# EAGLE design MainMCU (EAGLE 9.6.2)
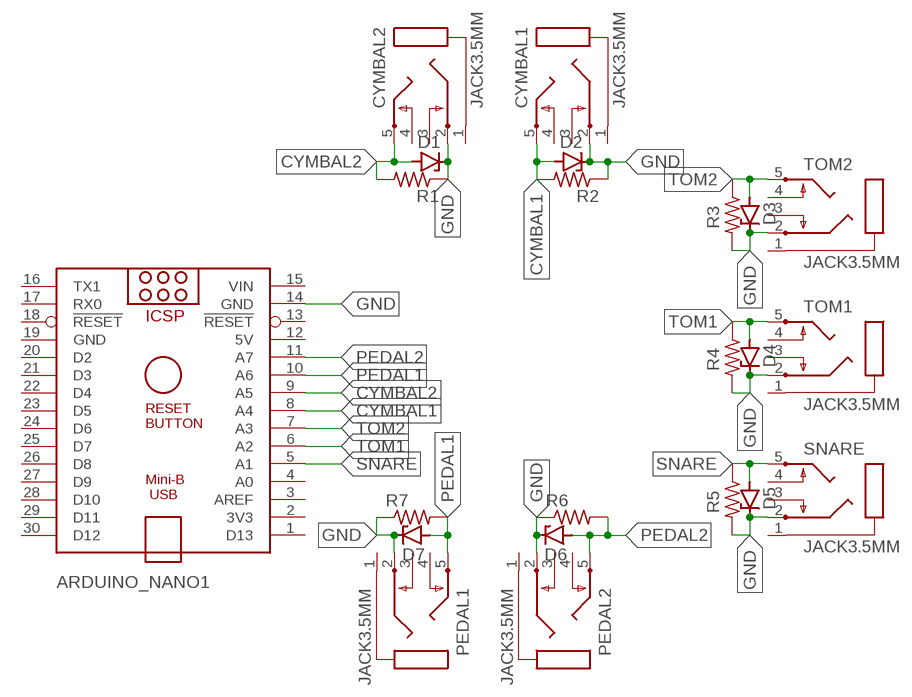
[diagram p0: schematic, sheet 1]

## Parts
ARDUINO_NANO1  ARDUINO_NANO  [ARDUINO_NANO]
CYMBAL1  JACK3.5MM  [PG203J]
CYMBAL2  JACK3.5MM  [PG203J]
D1  ZENER-DIODEDO34-7  [DO34Z7]
D2  ZENER-DIODEDO34-7  [DO34Z7]
D3  ZENER-DIODEDO34-7  [DO34Z7]
D4  ZENER-DIODEDO34-7  [DO34Z7]
D5  ZENER-DIODEDO34-7  [DO34Z7]
D6  ZENER-DIODEDO34-7  [DO34Z7]
D7  ZENER-DIODEDO34-7  [DO34Z7]
PEDAL1  JACK3.5MM  [PG203J]
PEDAL2  JACK3.5MM  [PG203J]
R1  R-US_0207/10  [0207/10]
R2  R-US_0207/10  [0207/10]
R3  R-US_0207/10  [0207/10]
R4  R-US_0207/10  [0207/10]
R5  R-US_0207/10  [0207/10]
R6  R-US_0207/10  [0207/10]
R7  R-US_0207/10  [0207/10]
SNARE  JACK3.5MM  [PG203J]
TOM1  JACK3.5MM  [PG203J]
TOM2  JACK3.5MM  [PG203J]

## Nets
CYMBAL1: ARDUINO_NANO1.8(A4) CYMBAL1.5 D2.A R2.2
CYMBAL2: ARDUINO_NANO1.9(A5) CYMBAL2.5 D1.A R1.2
GND: ARDUINO_NANO1.14(GND) CYMBAL1.2 CYMBAL2.2 D1.C D2.C D3.C D4.C D5.C D6.C D7.C PEDAL1.2 PEDAL2.2 R1.1 R2.1 R3.2 R4.2 R5.2 R6.1 R7.1 SNARE.2 TOM1.2 TOM2.2
PEDAL1: ARDUINO_NANO1.10(A6) D7.A PEDAL1.5 R7.2
PEDAL2: ARDUINO_NANO1.11(A7) D6.A PEDAL2.5 R6.2
SNARE: ARDUINO_NANO1.5(A1) D5.A R5.1 SNARE.5
TOM1: ARDUINO_NANO1.6(A2) D4.A R4.1 TOM1.5
TOM2: ARDUINO_NANO1.7(A3) D3.A R3.1 TOM2.5
Unconnected: ARDUINO_NANO1.1(D13) ARDUINO_NANO1.2(3V3) ARDUINO_NANO1.3(AREF) ARDUINO_NANO1.4(A0) ARDUINO_NANO1.13(!RESET) ARDUINO_NANO1.16(TX1) ARDUINO_NANO1.17(RX0) ARDUINO_NANO1.18(!RESET) ARDUINO_NANO1.20(D2) ARDUINO_NANO1.21(D3) ARDUINO_NANO1.22(D4) ARDUINO_NANO1.23(D5) ARDUINO_NANO1.24(D6) ARDUINO_NANO1.25(D7) ARDUINO_NANO1.26(D8) ARDUINO_NANO1.27(D9) ARDUINO_NANO1.28(D10) ARDUINO_NANO1.29(D11) ARDUINO_NANO1.30(D12) CYMBAL1.1 CYMBAL1.3 CYMBAL1.4 CYMBAL2.1 CYMBAL2.3 CYMBAL2.4 PEDAL1.1 PEDAL1.3 PEDAL1.4 PEDAL2.1 PEDAL2.3 PEDAL2.4 SNARE.1 SNARE.3 SNARE.4 TOM1.1 TOM1.3 TOM1.4 TOM2.1 TOM2.3 TOM2.4

## Power pins joined to a net without a drawn wire
5V: ARDUINO_NANO1.12(5V)
GND: ARDUINO_NANO1.19(GND)
VIN: ARDUINO_NANO1.15(VIN)

## Library data of the parts
ARDUINO_NANO1 = ArduinoNanoV30:ARDUINO_NANO: Arduino Nano V3.0 Overview: The Arduino Nano is a small, complete, and breadboard-friendly board based on the ATmega328 (Arduino Nano 3.x) or ATmega168 (Arduino Nano 2.x). It has more or less the same functionality of the Arduino Duemilanove, but in a different package. It lacks only a DC power jack, and works with a Mini-B USB cable instead of a standard one. The Nano was designed and is being produced by Gravitech. Specifications: Microcontroller Atmel ATmega168 or ATmega328 Operating Voltage (logic level) 5 V Input Voltage (recommended) 7-12 V Input Voltage (limits) 6-20 V Digital I/O Pins 14 (of which 6 provide PWM output) Analog Input Pins 8 DC Current per I/O Pin 40 mA Flash Memory 16 KB (ATmega168) or 32 KB (ATmega328) of which 2 KB used by bootloader SRAM 1 KB (ATmega168) or 2 KB (ATmega328) EEPROM 512 bytes (ATmega168) or 1 KB (ATmega328) Clock Speed 16 MHz Dimensions 0.73" x 1.70" Length 45 mm Width 18 mm Weigth 5 g Power: The Arduino Nano can be powered via the Mini-B USB connection, 6-20V unregulated external power supply (pin 30), or 5V regulated external power supply (pin 27). The power source is automatically selected to the highest voltage source. Memory: The ATmega168 has 16 KB of flash memory for storing code (of which 2 KB is used for the bootloader); the ATmega328 has 32 KB, (also with 2 KB used for the bootloader). The ATmega168 has 1 KB of SRAM and 512 bytes of EEPROM (which can be read and written with the EEPROM library); the ATmega328 has 2 KB of SRAM and 1 KB of EEPROM. Input and Output: Each of the 14 digital pins on the Nano can be used as an input or output, using pinMode(), digitalWrite(), and digitalRead() functions. They operate at 5 volts. Each pin can provide or receive a maximum of 40 mA and has an internal pull-up resistor (disconnected by default) of 20-50 kOhms. In addition, some pins have specialized functions. Visit Arduino - ArduinoBoardNano <https://www.arduino.cc/en/Main/ArduinoBoardNano>
CYMBAL1 CYMBAL2 PEDAL1 PEDAL2 SNARE TOM1 TOM2 = Jack3.5mmConnector:JACK3.5MM
D1-D7 = diode:ZENER-DIODE: Z-Diode
R1-R7 = rcl:R-US_: RESISTOR, American symbol; SPICEPREFIX: R

## Board
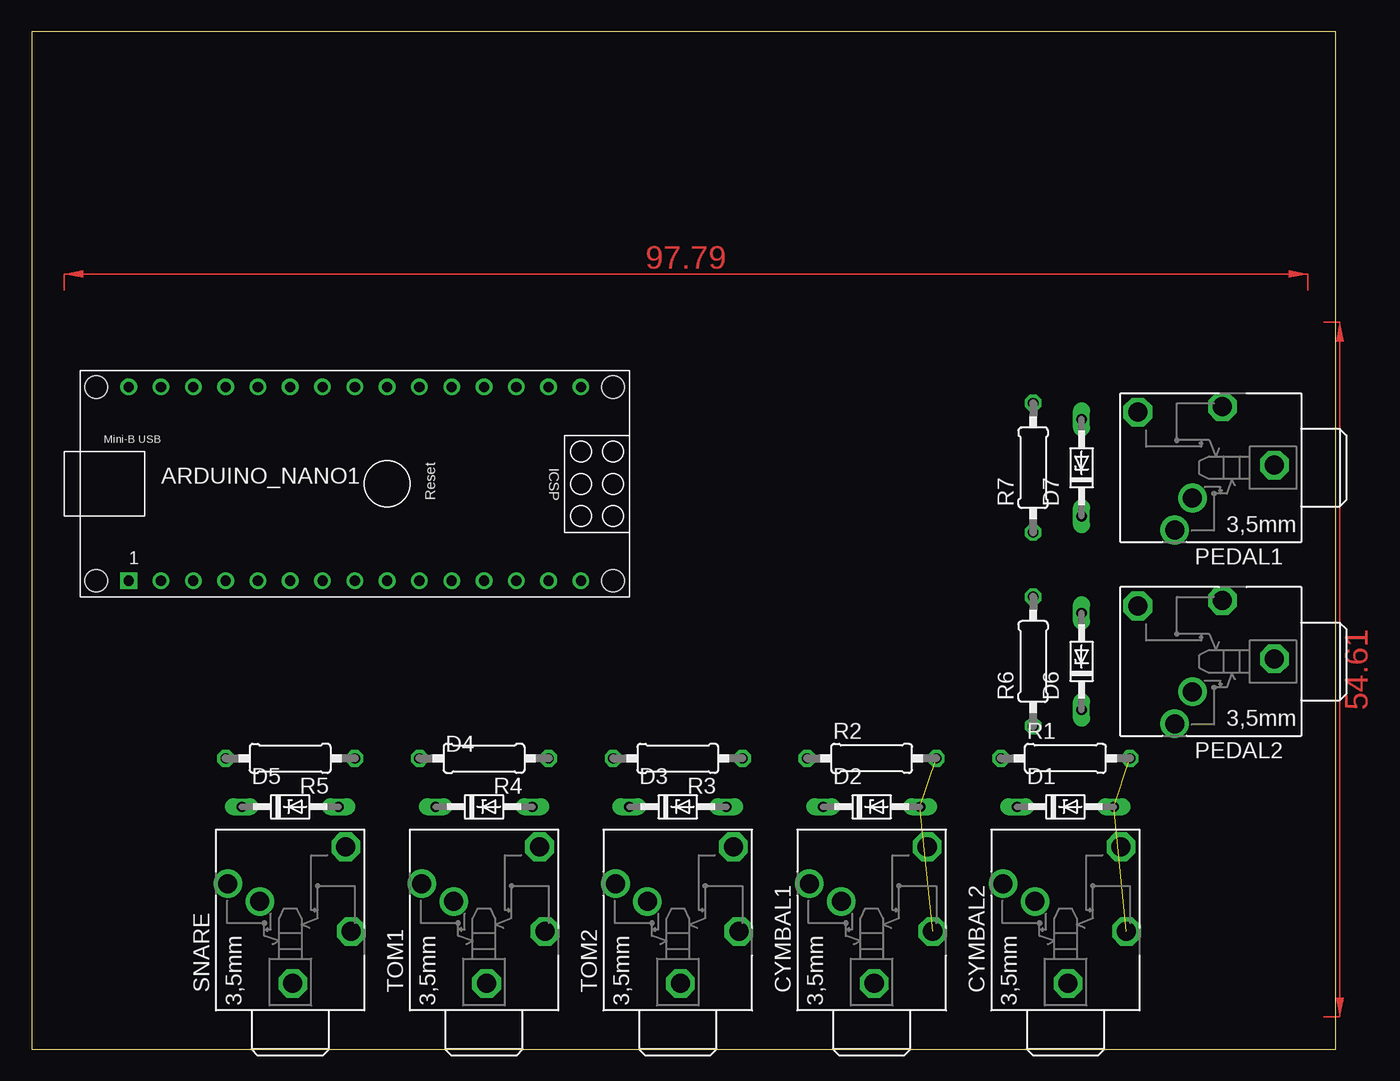
[diagram p1: board, top side]
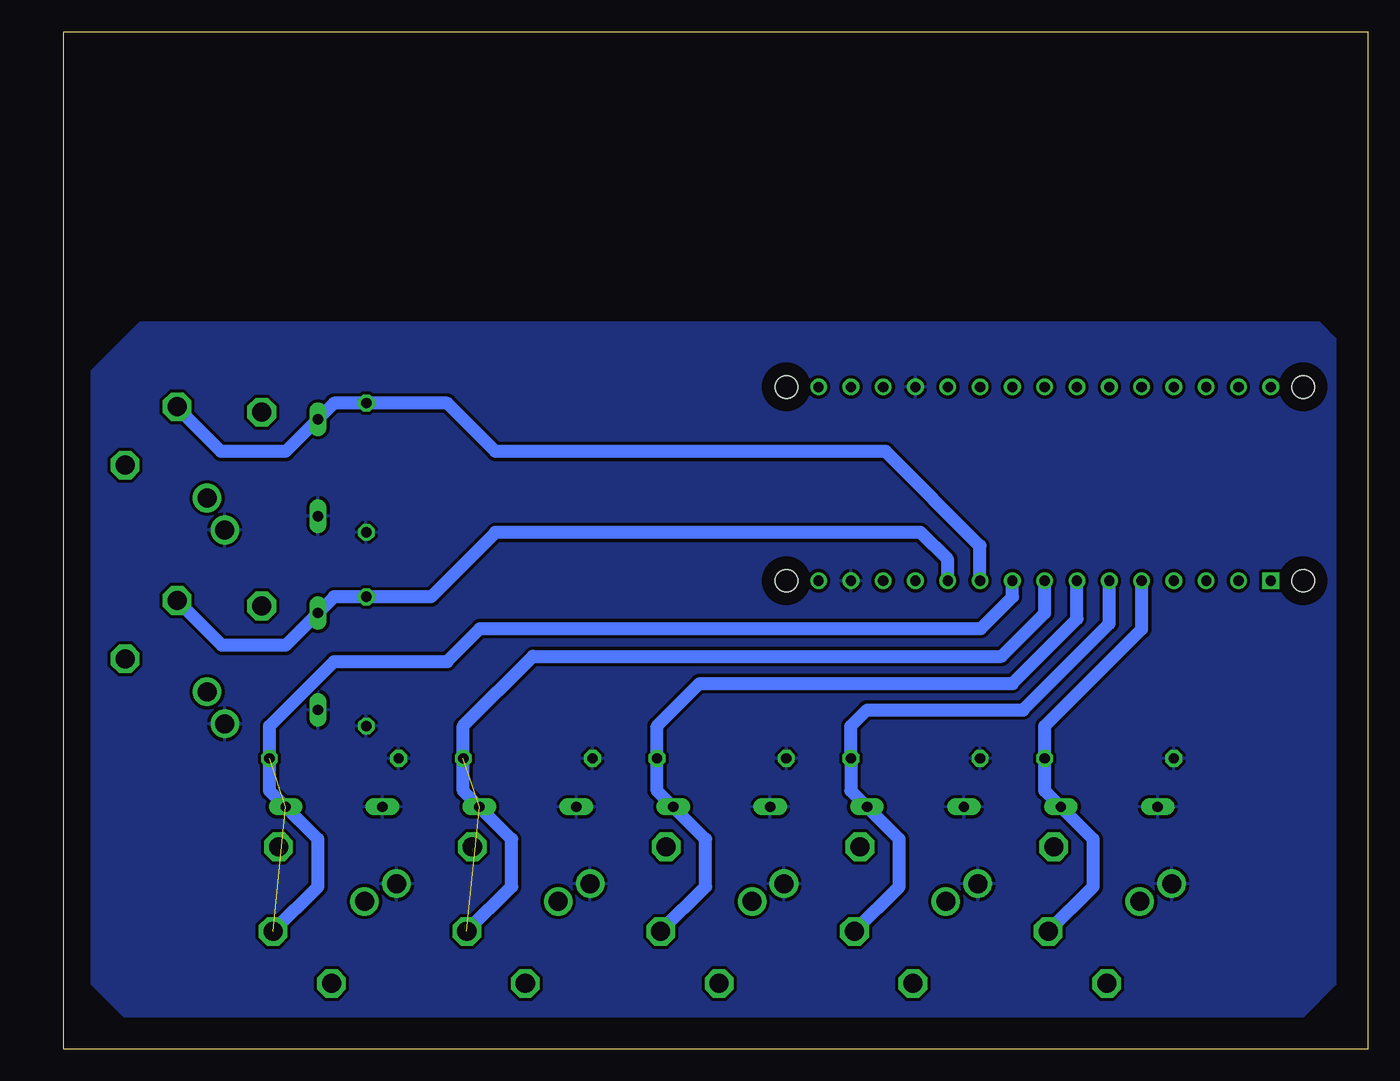
[diagram p2: board, bottom side, seen from below]

Size 102.54 x 80 mm. Coordinates in mm from the lower left corner, seen from the top.
Outline: 0,0 102.54,0 102.54,80 0,80 0,0
Copper layers (1*16): Top 0.035mm / dielectric 1.5mm / Bottom 0.035mm
Design rules "default": minimum track width 6mil, minimum drill 0.35mm, track to track 6mil, track to pad 6mil, pad to pad 6mil, via to via 6mil, smd to smd 6mil, copper to edge 40mil, drill to drill 6mil, minimum pad ring 10mil, minimum via ring 8mil, stop-mask expansion 4mil, vias tented up to drill 0mil, thermal gap 10mil

### Footprints (pad centres in the part's own frame; a part is rotated, then mirrored left to right if it is on the bottom)
ARDUINO_NANO = drill 0.8 square: 1 -20.32,-7.62 | drill 0.8: 2 -17.78,-7.62; 3 -15.24,-7.62; 4 -12.7,-7.62; 5 -10.16,-7.62; 6 -7.62,-7.62; 7 -5.08,-7.62; 8 -2.54,-7.62; 9 0,-7.62; 10 2.54,-7.62; 11 5.08,-7.62; 12 7.62,-7.62; 13 10.16,-7.62; 14 12.7,-7.62; 15 15.24,-7.62; 16 15.24,7.62; 17 12.7,7.62; 18 10.16,7.62; 19 7.62,7.62; 20 5.08,7.62; 21 2.54,7.62; 22 0,7.62; 23 -2.54,7.62; 24 -5.08,7.62; 25 -7.62,7.62; 26 -10.16,7.62; 27 -12.7,7.62; 28 -15.24,7.62; 29 -17.78,7.62; 30 -20.32,7.62 | hole 1.778: -22.86,-7.62; -22.86,7.62; 17.78,7.62; 17.78,-7.62
PG203J = drill 1.499 octagon: 1 -5.004,-0.203; 4 5.74,-4.369; 5 -0.914,-4.801 | drill 1.499: 2 2.845,4.902; 3 1.448,2.388
DO34Z7 = drill 0.813 long: A 3.81,0; C -3.81,0
0207/10 = drill 0.813 octagon: 1 -5.08,0; 2 5.08,0

### Placement (x,y rotation side)
ARDUINO_NANO1  27.94,44.45 0 top
CYMBAL1  66.04,10.16 90 top
CYMBAL2  81.28,10.16 90 top
D1  81.28,19.05 0 top
D2  66.04,19.05 0 top
D3  50.8,19.05 0 top
D4  35.56,19.05 0 top
D5  20.32,19.05 0 top
D6  82.55,30.48 90 top
D7  82.55,45.72 90 top
PEDAL1  92.71,45.72 180 top
PEDAL2  92.71,30.48 180 top
R1  81.28,22.86 0 top
R2  66.04,22.86 0 top
R3  50.8,22.86 180 top
R4  35.56,22.86 180 top
R5  20.32,22.86 180 top
R6  78.74,30.48 90 top
R7  78.74,45.72 90 top
SNARE  20.32,10.16 90 top
TOM1  35.56,10.16 90 top
TOM2  50.8,10.16 90 top

### Tracks (layer width: path | path; a pad name or v marks a point on that pad's centre or on a via)
CYMBAL1  (2 unrouted)
  Bottom 1.016: CYMBAL1.5 67.31,12.78 67.31,16.51 71.12,20.32 71.12,25.4 65.63,30.89 28.8,30.89 25.4,34.29 ARDUINO_NANO1.8
CYMBAL2  (2 unrouted)
  Bottom 1.016: CYMBAL2.5 82.55,12.78 82.55,16.51 86.36,20.32 86.36,25.4 81.28,30.48 72.39,30.48 69.8,33.07 30.43,33.07 27.94,35.56 ARDUINO_NANO1.9
GND
  pour Bottom (isolate 0.254): 2.54,5.08 5.08,2.54 97.79,2.54 100.33,5.08 100.33,53.34 96.52,57.15 3.81,57.15 2.54,55.88
PEDAL1
  Bottom 1.016: ARDUINO_NANO1.10 30.48,39.57 37.9,46.99 68.58,46.99 72.39,50.8 R7.2 81.28,50.8 D7.A 85.09,46.99 90.17,46.99 93.62,50.44 PEDAL1.5
PEDAL2
  Bottom 1.016: ARDUINO_NANO1.11 33.02,38.48 35.18,40.64 68.58,40.64 73.66,35.56 R6.2 81.28,35.56 D6.A 85.09,31.75 90.09,31.75 PEDAL2.5
SNARE
  Bottom 1.016: SNARE.5 21.59,12.78 21.59,16.51 D5.A 25.4,20.32 R5.1 25.4,25.4 17.78,33.02 ARDUINO_NANO1.5
TOM1
  Bottom 1.016: TOM1.5 36.83,12.78 36.83,16.51 D4.A 40.64,20.32 R4.1 40.64,25.4 39.37,26.67 27.1,26.67 20.32,33.45 ARDUINO_NANO1.6
TOM2
  Bottom 1.016: TOM2.5 52.07,12.78 52.07,16.51 D3.A 55.88,20.32 R3.1 55.88,25.4 52.53,28.75 27.94,28.75 22.86,33.83 ARDUINO_NANO1.7
(copper drawn outside any net)
  shapes: Top area x2